# Altium schematic sheet HYDRA_V4_RECOVERY.SchDoc
size C; SheetNumber: 1; SheetTotal: 10
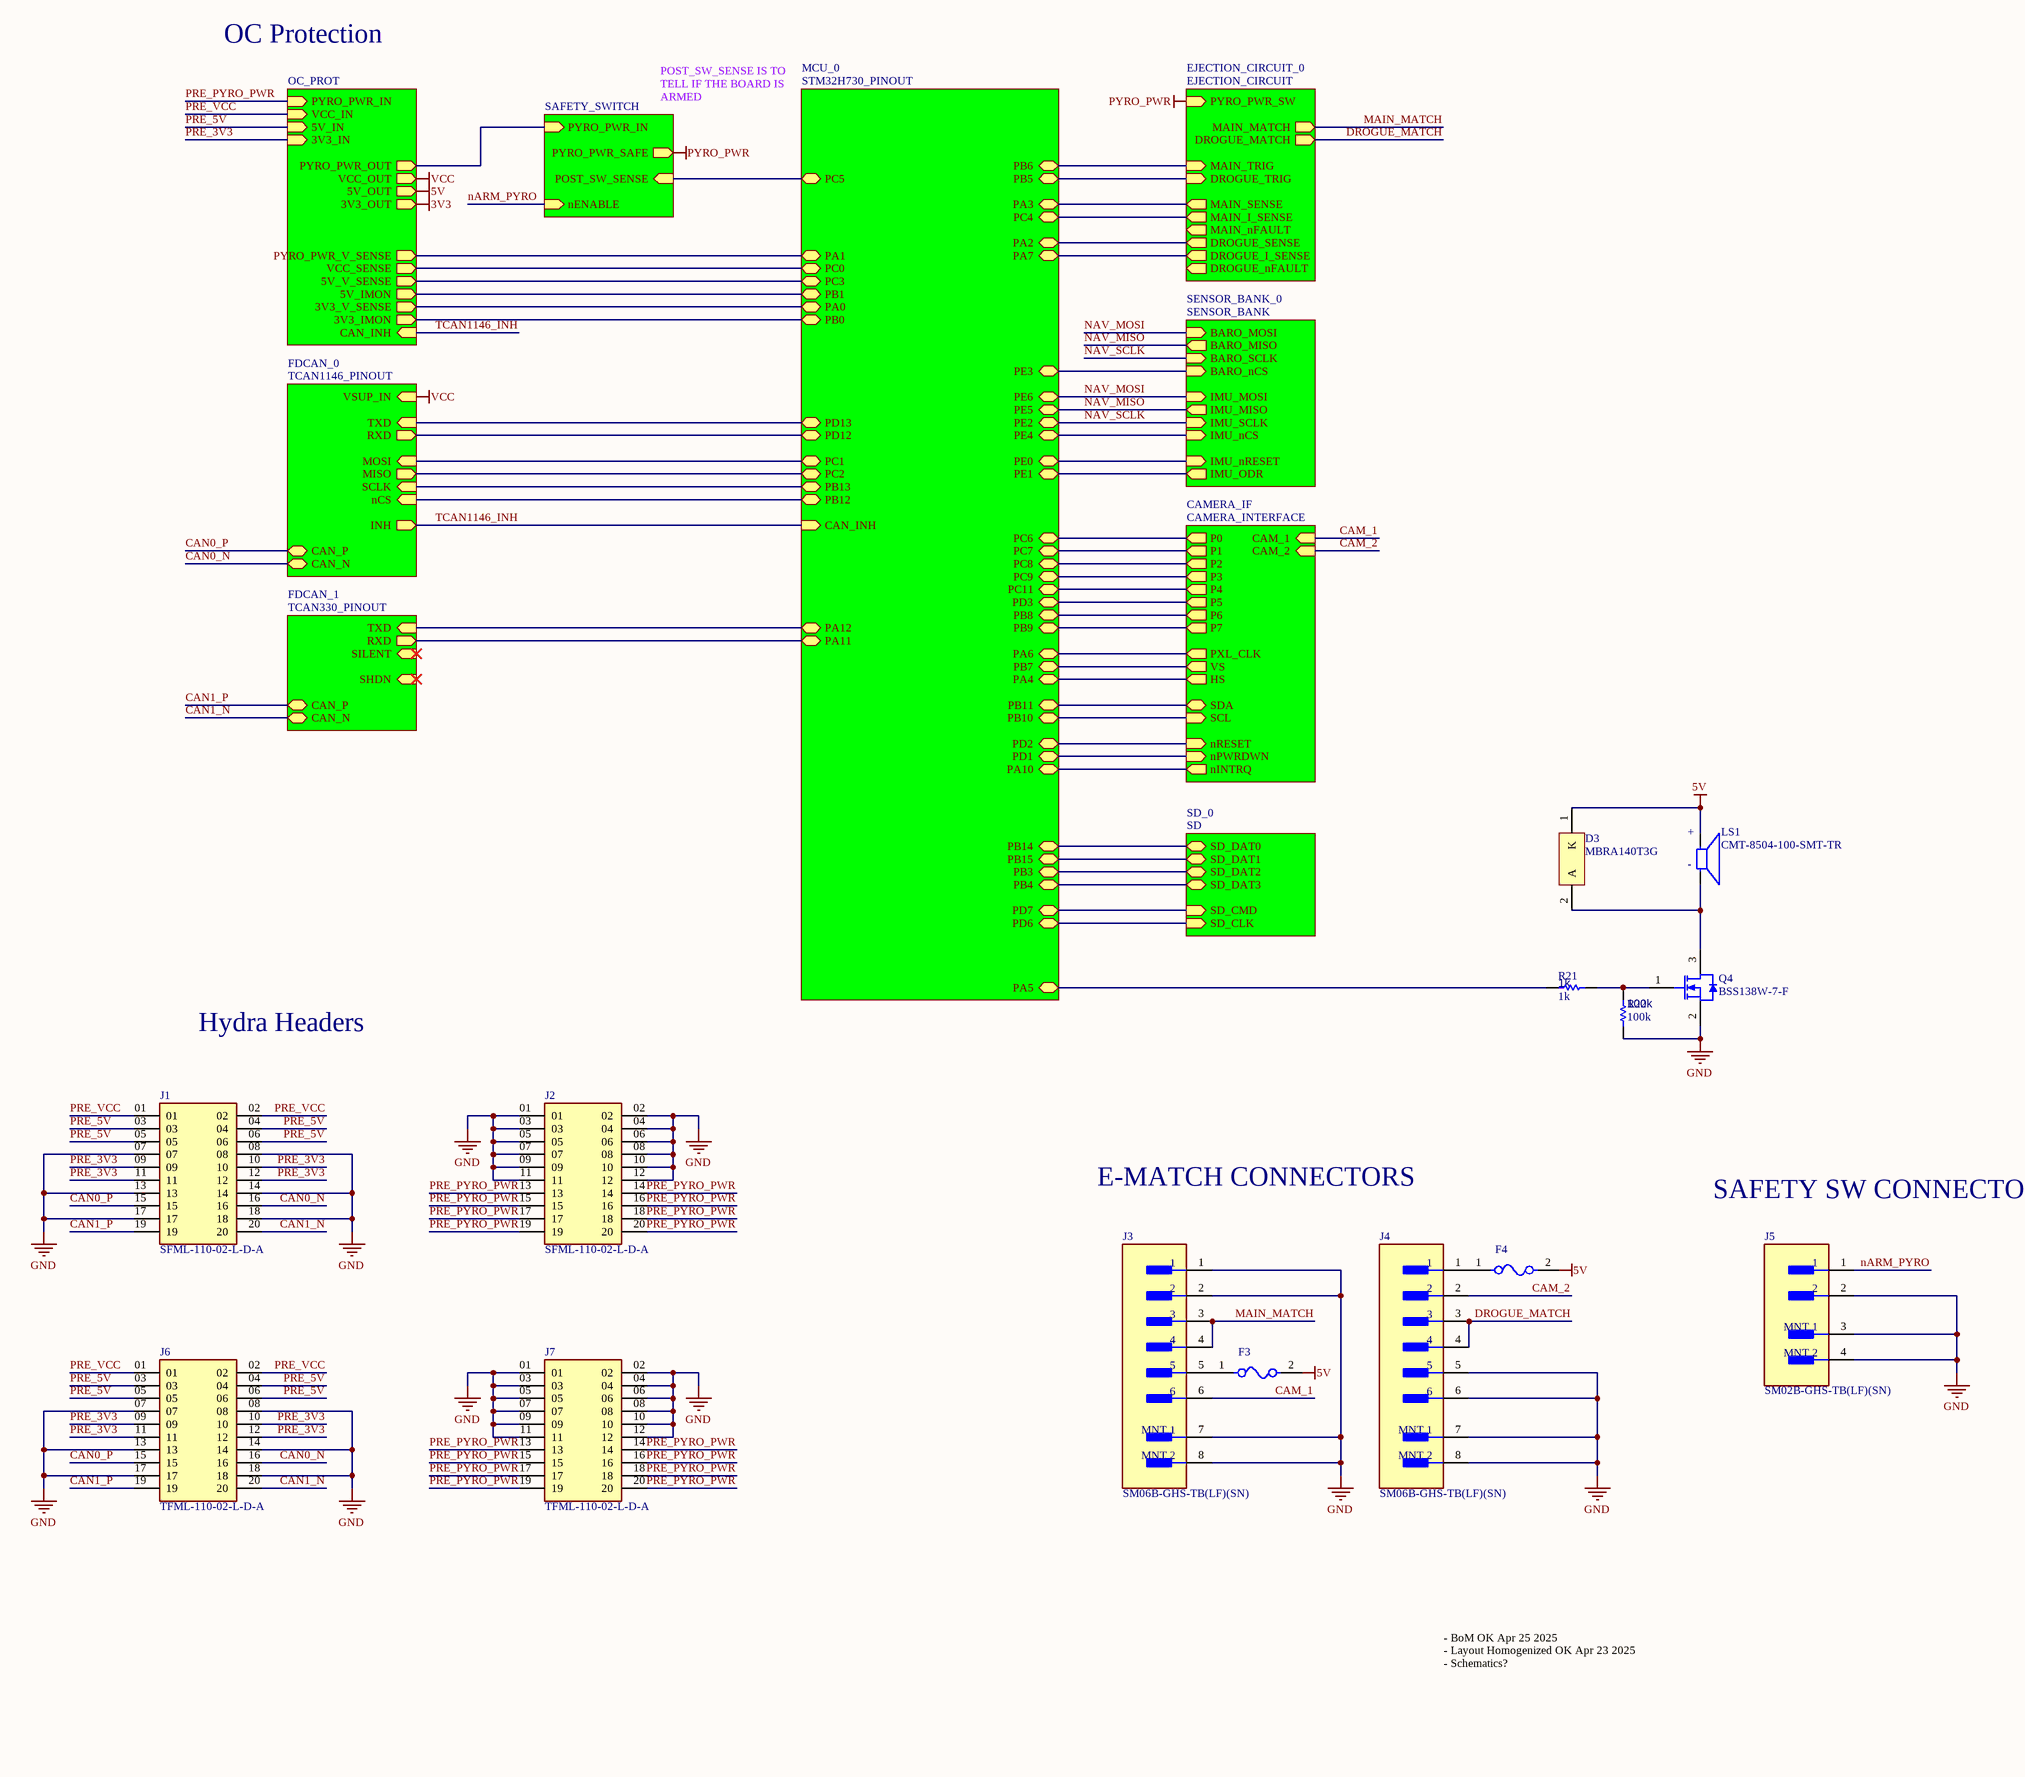
[diagram p0: HYDRA_V4_RECOVERY.SchDoc]

## Parts
D3  MBRA140T3G  [ONSC-SMA-2-403D-02_V]
F3  MF-FSMF050X-2  [FP-MF-FSMF-MFG]  (value not drawn)
F4  MF-FSMF050X-2  [FP-MF-FSMF-MFG]  (value not drawn)
J1  SFML-110-02-L-D-A  [SFML-110-02-L-D-A-Footprint-1]
J2  SFML-110-02-L-D-A  [SFML-110-02-L-D-A-Footprint-1]
J3  SM06B-GHS-TB(LF)(SN)  [FP-SM06B-GHS-TB_LF_SN-MFG]
J4  SM06B-GHS-TB(LF)(SN)  [FP-SM06B-GHS-TB_LF_SN-MFG]
J5  SM02B-GHS-TB(LF)(SN)  [FP-SM02B-GHS-TB_LF_SN-MFG]
J6  TFML-110-02-L-D-A  [TFML-110-02-L-D-A-Footprint-1]
J7  TFML-110-02-L-D-A  [TFML-110-02-L-D-A-Footprint-1]
LS1  CMT-8504-100-SMT-TR  [CMT-8504-100-SMT-TR-Footprint-1]
Q4  BSS138W-7-F  [DIOD-SOT323-3_V]
R21  1k  [R0603B]
R22  100k  [R0603B]

## Sub-sheets
CAMERA_IF = CAMERA_INTERFACE: P0 (out), P1 (out), P2 (out), P3 (out), P4 (out), P5 (out), P6 (out), P7 (out), PXL_CLK (out), VS (out), HS (out), SDA (bidir), SCL (in), nRESET (in), nPWRDWN (in), CAM_1 (in), CAM_2 (in), nINTRQ (out)
EJECTION_CIRCUIT_0 = EJECTION_CIRCUIT: MAIN_TRIG (in), DROGUE_TRIG (in), PYRO_PWR_SW (in), MAIN_SENSE (out), DROGUE_SENSE (out), MAIN_I_SENSE (out), DROGUE_I_SENSE (out), MAIN_MATCH (out), DROGUE_MATCH (out), MAIN_nFAULT (out), DROGUE_nFAULT (out)
FDCAN_0 = TCAN1146_PINOUT: TXD (in), RXD (out), MOSI (in), MISO (out), SCLK (in), nCS (in), INH (out), CAN_P (bidir), CAN_N (bidir), VSUP_IN (in)
FDCAN_1 = TCAN330_PINOUT: TXD (in), RXD (out), SHDN (in), SILENT (in), CAN_P (bidir), CAN_N (bidir)
MCU_0 = STM32H730_PINOUT: CAN_INH (in), PD3 (bidir), PA4 (bidir), PA6 (bidir), PB7 (bidir), PB8 (bidir), PB9 (bidir), PC6 (bidir), PC7 (bidir), PC8 (bidir), PC9 (bidir), PC11 (bidir), PE2 (bidir), PE4 (bidir), PE5 (bidir), PE6 (bidir), PE3 (bidir), PB12 (bidir), PB13 (bidir), PB14 (bidir), PB15 (bidir), PD12 (bidir), PD13 (bidir), PA11 (bidir), PA12 (bidir), PD6 (bidir), PD7 (bidir), PB4 (bidir), PB3 (bidir), PC2 (bidir), PC1 (bidir), PB10 (bidir), PB11 (bidir), PD1 (bidir), PD2 (bidir), PE0 (bidir), PE1 (bidir), PC0 (bidir), PC3 (bidir), PA0 (bidir), PA1 (bidir), PA2 (bidir), PA3 (bidir), PB1 (bidir), PB0 (bidir), PC4 (bidir), PC5 (bidir), PB5 (bidir), PB6 (bidir), PA7 (bidir), PA5 (bidir), PA10 (bidir)
OC_PROT = OC_PROT: PYRO_PWR_IN (in), PYRO_PWR_V_SENSE (out), VCC_SENSE (out), 3V3_IMON (out), CAN_INH (in), VCC_IN (in), 5V_IN (in), 3V3_IN (in), PYRO_PWR_OUT (out), VCC_OUT (out), 5V_OUT (out), 3V3_OUT (out), 3V3_V_SENSE (out), 5V_V_SENSE (out), 5V_IMON (out)
SAFETY_SWITCH_0 = SAFETY_SWITCH: PYRO_PWR_IN (in), PYRO_PWR_SAFE (out), nENABLE (in), POST_SW_SENSE (in)
SD_0 = SD: SD_DAT0 (bidir), SD_DAT1 (bidir), SD_DAT2 (bidir), SD_DAT3 (bidir), SD_CMD (in), SD_CLK (in)
SENSOR_BANK_0 = SENSOR_BANK: IMU_MOSI (in), IMU_MISO (out), IMU_ODR (out), IMU_nCS (in), IMU_SCLK (in), IMU_nRESET (in), BARO_SCLK (in), BARO_MOSI (in), BARO_MISO (out), BARO_nCS (in)

## Nets
3V3: sheet OC_PROT/3V3_OUT
5V: D3.1(K) F3.2 F4.2 LS1.P ; sheet OC_PROT/5V_OUT
GND: J1.07 J1.08 J1.13 J1.14 J1.17 J1.18 J2.01 J2.02 J2.03 J2.04 J2.05 J2.06 J2.07 J2.08 J2.09 J2.10 J2.11 J2.12 J3.1 J3.2 J3.7(MNT_1) J3.8(MNT_2) J4.5 J4.6 J4.7(MNT_1) J4.8(MNT_2) J5.2 J5.3(MNT_1) J5.4(MNT_2) J6.07 J6.08 J6.13 J6.14 J6.17 J6.18 J7.01 J7.02 J7.03 J7.04 J7.05 J7.06 J7.07 J7.08 J7.09 J7.10 J7.11 J7.12 Q4.2(S) R22.2
PYRO_PWR: sheet EJECTION_CIRCUIT_0/PYRO_PWR_SW, sheet SAFETY_SWITCH_0/PYRO_PWR_SAFE
VCC: sheet OC_PROT/VCC_OUT, sheet FDCAN_0/VSUP_IN
CAM_1: J3.6 ; sheet CAMERA_IF/CAM_1
CAM_2: J4.2 ; sheet CAMERA_IF/CAM_2
CAN0_N: J1.16 J6.16 ; sheet FDCAN_0/CAN_N
CAN0_P: J1.15 J6.15 ; sheet FDCAN_0/CAN_P
CAN1_N: J1.20 J6.20 ; sheet FDCAN_1/CAN_N
CAN1_P: J1.19 J6.19 ; sheet FDCAN_1/CAN_P
DROGUE_MATCH: J4.3 J4.4 ; sheet EJECTION_CIRCUIT_0/DROGUE_MATCH
MAIN_MATCH: J3.3 J3.4 ; sheet EJECTION_CIRCUIT_0/MAIN_MATCH
nARM_PYRO: J5.1 ; sheet SAFETY_SWITCH_0/nENABLE
NAV_MISO: sheet MCU_0/PE5, sheet SENSOR_BANK_0/IMU_MISO, sheet SENSOR_BANK_0/BARO_MISO
NAV_MOSI: sheet MCU_0/PE6, sheet SENSOR_BANK_0/IMU_MOSI, sheet SENSOR_BANK_0/BARO_MOSI
NAV_SCLK: sheet MCU_0/PE2, sheet SENSOR_BANK_0/IMU_SCLK, sheet SENSOR_BANK_0/BARO_SCLK
PRE_3V3: J1.09 J1.10 J1.11 J1.12 J6.09 J6.10 J6.11 J6.12 ; sheet OC_PROT/3V3_IN
PRE_5V: J1.03 J1.04 J1.05 J1.06 J6.03 J6.04 J6.05 J6.06 ; sheet OC_PROT/5V_IN
PRE_PYRO_PWR: J2.13 J2.14 J2.15 J2.16 J2.17 J2.18 J2.19 J2.20 J7.13 J7.14 J7.15 J7.16 J7.17 J7.18 J7.19 J7.20 ; sheet OC_PROT/PYRO_PWR_IN
PRE_VCC: J1.01 J1.02 J6.01 J6.02 ; sheet OC_PROT/VCC_IN
TCAN1146_INH: sheet OC_PROT/CAN_INH, sheet MCU_0/CAN_INH, sheet FDCAN_0/INH
NetD3_2: D3.2(A) LS1.N Q4.3(D)
NetF3_1: F3.1 J3.5
NetF4_1: F4.1 J4.1
NetQ4_1: Q4.1(G) R21.1 R22.1
NetR21_2: R21.2 ; sheet MCU_0/PA5
(unnamed): sheet OC_PROT/PYRO_PWR_V_SENSE, sheet MCU_0/PA1
(unnamed): sheet OC_PROT/VCC_SENSE, sheet MCU_0/PC0
(unnamed): sheet OC_PROT/3V3_IMON, sheet MCU_0/PB0
(unnamed): sheet OC_PROT/PYRO_PWR_OUT, sheet SAFETY_SWITCH_0/PYRO_PWR_IN
(unnamed): sheet OC_PROT/3V3_V_SENSE, sheet MCU_0/PA0
(unnamed): sheet OC_PROT/5V_V_SENSE, sheet MCU_0/PC3
(unnamed): sheet OC_PROT/5V_IMON, sheet MCU_0/PB1
(unnamed): sheet MCU_0/PD3, sheet CAMERA_IF/P5
(unnamed): sheet MCU_0/PA4, sheet CAMERA_IF/HS
(unnamed): sheet MCU_0/PA6, sheet CAMERA_IF/PXL_CLK
(unnamed): sheet MCU_0/PB7, sheet CAMERA_IF/VS
(unnamed): sheet MCU_0/PB8, sheet CAMERA_IF/P6
(unnamed): sheet MCU_0/PB9, sheet CAMERA_IF/P7
(unnamed): sheet MCU_0/PC6, sheet CAMERA_IF/P0
(unnamed): sheet MCU_0/PC7, sheet CAMERA_IF/P1
(unnamed): sheet MCU_0/PC8, sheet CAMERA_IF/P2
(unnamed): sheet MCU_0/PC9, sheet CAMERA_IF/P3
(unnamed): sheet MCU_0/PC11, sheet CAMERA_IF/P4
(unnamed): sheet MCU_0/PE4, sheet SENSOR_BANK_0/IMU_nCS
(unnamed): sheet MCU_0/PE3, sheet SENSOR_BANK_0/BARO_nCS
(unnamed): sheet MCU_0/PB12, sheet FDCAN_0/nCS
(unnamed): sheet MCU_0/PB13, sheet FDCAN_0/SCLK
(unnamed): sheet MCU_0/PB14, sheet SD_0/SD_DAT0
(unnamed): sheet MCU_0/PB15, sheet SD_0/SD_DAT1
(unnamed): sheet MCU_0/PD12, sheet FDCAN_0/RXD
(unnamed): sheet MCU_0/PD13, sheet FDCAN_0/TXD
(unnamed): sheet MCU_0/PA11, sheet FDCAN_1/RXD
(unnamed): sheet MCU_0/PA12, sheet FDCAN_1/TXD
(unnamed): sheet MCU_0/PD6, sheet SD_0/SD_CLK
(unnamed): sheet MCU_0/PD7, sheet SD_0/SD_CMD
(unnamed): sheet MCU_0/PB4, sheet SD_0/SD_DAT3
(unnamed): sheet MCU_0/PB3, sheet SD_0/SD_DAT2
(unnamed): sheet MCU_0/PC2, sheet FDCAN_0/MISO
(unnamed): sheet MCU_0/PC1, sheet FDCAN_0/MOSI
(unnamed): sheet MCU_0/PB10, sheet CAMERA_IF/SCL
(unnamed): sheet MCU_0/PB11, sheet CAMERA_IF/SDA
(unnamed): sheet MCU_0/PD1, sheet CAMERA_IF/nPWRDWN
(unnamed): sheet MCU_0/PD2, sheet CAMERA_IF/nRESET
(unnamed): sheet MCU_0/PE0, sheet SENSOR_BANK_0/IMU_nRESET
(unnamed): sheet MCU_0/PE1, sheet SENSOR_BANK_0/IMU_ODR
(unnamed): sheet MCU_0/PA2, sheet EJECTION_CIRCUIT_0/DROGUE_SENSE
(unnamed): sheet MCU_0/PA3, sheet EJECTION_CIRCUIT_0/MAIN_SENSE
(unnamed): sheet MCU_0/PC4, sheet EJECTION_CIRCUIT_0/MAIN_I_SENSE
(unnamed): sheet MCU_0/PC5, sheet SAFETY_SWITCH_0/POST_SW_SENSE
(unnamed): sheet MCU_0/PB5, sheet EJECTION_CIRCUIT_0/DROGUE_TRIG
(unnamed): sheet MCU_0/PB6, sheet EJECTION_CIRCUIT_0/MAIN_TRIG
(unnamed): sheet MCU_0/PA7, sheet EJECTION_CIRCUIT_0/DROGUE_I_SENSE
(unnamed): sheet MCU_0/PA10, sheet CAMERA_IF/nINTRQ

## Notes on the sheet
- OC Protection
- POST_SW_SENSE IS TO TELL IF THE BOARD IS ARMED
- Hydra Headers
- E-MATCH CONNECTORS
- SAFETY SW CONNECTOR
- - BoM OK Apr 25 2025
  - Layout Homogenized OK Apr 23 2025
  - Schematics?
- (in symbol CMP-00030-00002-1) +; -

## Library data of the parts
D3 = CMP-1055-00320-1: Schottky Power Rectifier, 2-Pin SMA, Pb-Free, Tape and Reel; Manufacturer: On Semiconductor; Configuration: Single; IFSM Max (A): 30; PackageReference: SMA-2-403D-02; PackageDescription: 2-Pin Small Molded Package, J-Bend Lead, Body 2.605 x 4.315 mm; RoHS: TRUE; ComponentLink1Description: Manufacturer URL; Packing: Tape and Reel; ComponentLink3URL: http://www.onsemi.com/pub_link/Collateral/403D-02.PDF; ComponentLink2Description: Datasheet; ComponentLink2URL: http://www.onsemi.cn/pub_link/Collateral/MBRA140T3-D.PDF; DatasheetVersion: Rev. 10; ComponentLink1URL: http://www.onsemi.com/; PartNumber: MBRA140T3G; ComponentLink3Description: Package Specification; Mounting Technology: Surface Mount; PackageVersion: Rev. G, 07/2012
F3 F4 = CMP-07400-000010-1: PTC RESET FUSE 6V 500MA 0603; Manufacturer: Bourns Inc.; Trip Current: 1A; Current Rating: 40A; Hold Current: 0.5A; Resistance: 0.1-0.8Ω; Value: 0.1-0.8Ω; Trip Time: 0.1s; Mouser Description: Resettable Fuses - PPTC 6volts 40amps; Category: Fuse; Digikey Description: PTC RESET FUSE 6V 500MA 0603; Temperature: -40°C to +85°C; Device Class L3: unset; Automotive: No; RoHS: TRUE; Ambient Temperature Range High: +85°C; Device Class L2: PTC Resettable Fuses; Temperature Range High: +85°C; Voltage Rating: 6V; Package: MF-FSMF; Manufacturer Part Number: MF-FSMF050X-2; Ambient Temperature Range Low: -40°C; Lead Free: Yes; ComponentLink2Description: Datasheet; Octopart: https://octopart.com/mf-fsmf050x-2-bourns-10470804; ComponentLink2URL: https://www.bourns.com/docs/Product-Datasheets/mffsmf.pdf; Temperature Range Low: -40°C; Height: 1mm; Device Class L1: Circuit Protection
J1 J2 = CMP-002-00043-1: Board Connector, 20 Contact(s), 2 Row(s), Female, Straight, 0.05 inch Pitch, Surface Mount Terminal, Locking, Black Insulator, Socket; RoHS Compliant: Yes; Connector Type: BOARD CONNECTOR; Mounting Technology: Board
J3 J4 = CMP-002-00082-1: Conn Shrouded Header HDR 6 POS 1.25mm Solder RA Side Entry SMD T/R
J5 = CMP-002-00083-1: MCU 32-bit LPC1800 ARM Cortex M3 RISC 768KB Flash 3.3V 100-Pin TFBGA Tray
J6 J7 = CMP-002-00042-3: Board Connector, 20 Contact(s), 2 Row(s), Male, Straight, Surface Mount Terminal; Connector Type: BOARD CONNECTOR; Mounting Technology: Board; RoHS Compliant: Yes
LS1 = CMP-00030-00002-1: 8.5 mm, 5 Vo-p, 100 dB, Surface Mount (SMT), Magnetic Audio Transducer Buzzer
Q4 = CMP-2000-05968-1: N-Channel Enhancement Mode Mosfet, 50 V, 200 mA, -55 to 150 degC, 6-Pin SOT-323, RoHS, Tape and Reel; Typical Turn-Off Delay Time: 20ns; Number of Channels: 1Channel; Type: EnhancementModeFieldEffectTransistor; Brand: DiodesIncorporated; Vds - Drain-Source Breakdown Voltage: 75V; Vgs - Gate-Source Voltage: 20V; Rds On - Drain-Source Resistance: 1.4Ohms; Transistor Type: 1N-Channel; Configuration: Single; Unit Weight: 0.000212oz; Pd - Power Dissipation: 200mW; Id - Continuous Drain Current: 200mA; Forward Transconductance - Min: 0.1S; Manufacturer URL: http://www.diodes.com/; Series: BSS138; Package Description: 3-Pin Small Outline Transistor, Body 2 x 1.25 mm, Pitch 0.65 mm; Mounting Technology: SurfaceMount; Product Category: MOSFET; RoHS: True; Maximum Operating Temperature: +150C; Height: 1mm; Length: 2.2mm; Technology: Si; Width: 1.35mm; Datasheet URL: http://www.diodes.com/_files/datasheets/ds30206.pdf; Manufacturer: DiodesIncorporated; Package / Case: SOT-323-3; Typical Turn-On Delay Time: 20ns; Transistor Polarity: N-Channel; Factory Pack Quantity: 3000; Packaging: Reel; Product: MOSFETSmallSignal; Datasheet Version: Rev. 11-2, 09/2013; Package Reference: SOT323; Minimum Operating Temperature: -55C; Mounting Style: SMD/SMT; Channel Mode: Enhancement
R21 R22 = CMP-009-00002-14: Resistor
  R21: Value: 1k
  R22: Value: 100k